# Altium schematic sheet AVR Board 4.0 Ports -Old.SchDoc
size A
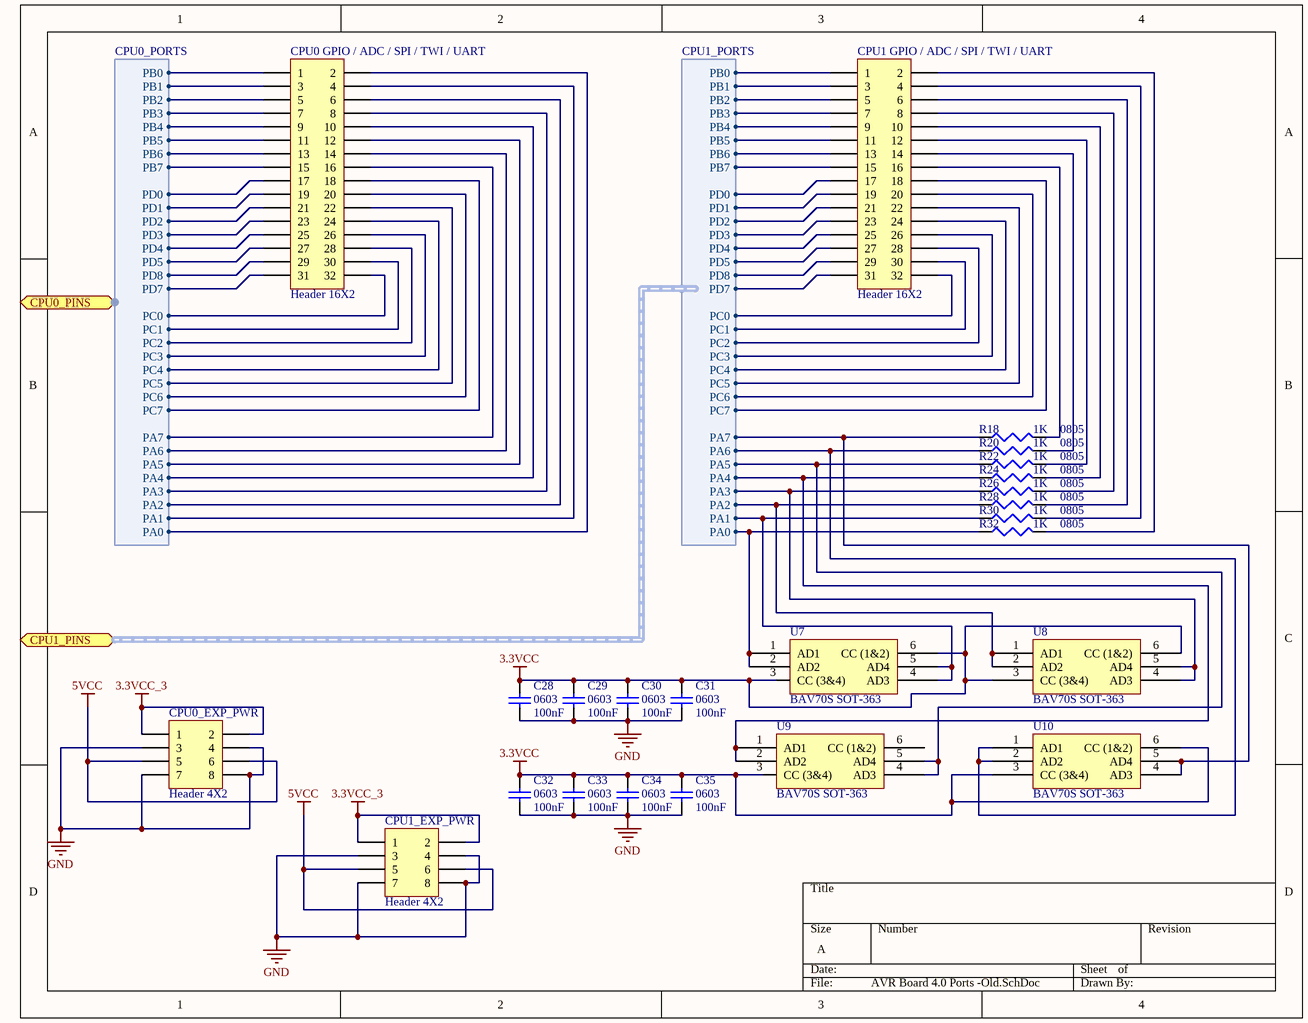
[diagram p0: AVR Board 4.0 Ports -Old.SchDoc]

## Parts
C28  0603  value 100nF  [C1206]
C29  0603  value 100nF  [C1206]
C30  0603  value 100nF  [C1206]
C31  0603  value 100nF  [C1206]
C32  0603  value 100nF  [C1206]
C33  0603  value 100nF  [C1206]
C34  0603  value 100nF  [C1206]
C35  0603  value 100nF  [C1206]
CPU0_EXP_PWR  Header 4X2  [HDR2X4]
CPU0_GPIO_/_ADC_/_SPI_/_TWI_/_UART  Header 16X2  [HDR2X16]
CPU1_EXP_PWR  Header 4X2  [HDR2X4]
CPU1_GPIO_/_ADC_/_SPI_/_TWI_/_UART  Header 16X2  [HDR2X16]
R18  0805  value 1K  [SM 0805 - gap trimmed]
R20  0805  value 1K  [SM 0805 - gap trimmed]
R22  0805  value 1K  [SM 0805 - gap trimmed]
R24  0805  value 1K  [SM 0805 - gap trimmed]
R26  0805  value 1K  [SM 0805 - gap trimmed]
R28  0805  value 1K  [SM 0805 - gap trimmed]
R30  0805  value 1K  [SM 0805 - gap trimmed]
R32  0805  value 1K  [SM 0805 - gap trimmed]
U7  BAV70S SOT-363  [BAV70S_SOT363]
U8  BAV70S SOT-363  [BAV70S_SOT363]
U9  BAV70S SOT-363  [BAV70S_SOT363]
U10  BAV70S SOT-363  [BAV70S_SOT363]

## Ports
CPU0_PINS (harness CPU0_PORTS), CPU1_PINS (harness CPU1_PORTS)

## Harnesses
CPU0_PORTS: PA0, PA1, PA2, PA3, PA4, PA5, PA6, PA7, PC0, PC1, PC2, PC3, PC4, PC5, PC6, PC7, PD7, PD8, PD5, PD4, PD3, PD2, PD1, PD0, PB7, PB6, PB5, PB4, PB3, PB2, PB1, PB0
CPU1_PORTS: PA0, PA1, PA2, PA3, PA4, PA5, PA6, PA7, PC0, PC1, PC2, PC3, PC4, PC5, PC6, PC7, PD7, PD8, PD5, PD4, PD3, PD2, PD1, PD0, PB7, PB6, PB5, PB4, PB3, PB2, PB1, PB0

## Nets
3.3VCC: C28.2 C29.2 C30.2 C31.2 C32.2 C33.2 C34.2 C35.2 U7.3(CC_(3&4)) U7.6(CC_(1&2)) U8.3(CC_(3&4)) U8.6(CC_(1&2)) U9.3(CC_(3&4)) U10.3(CC_(3&4)) U10.6(CC_(1&2))
3.3VCC_3: CPU0_EXP_PWR.1 CPU0_EXP_PWR.2 CPU1_EXP_PWR.1 CPU1_EXP_PWR.2
5VCC: CPU0_EXP_PWR.5 CPU0_EXP_PWR.6 CPU1_EXP_PWR.5 CPU1_EXP_PWR.6
GND: C28.1 C29.1 C30.1 C31.1 C32.1 C33.1 C34.1 C35.1 CPU0_EXP_PWR.3 CPU0_EXP_PWR.4 CPU0_EXP_PWR.7 CPU0_EXP_PWR.8 CPU1_EXP_PWR.3 CPU1_EXP_PWR.4 CPU1_EXP_PWR.7 CPU1_EXP_PWR.8
NetCPU0_GPIO_/_ADC_/_SPI_/_TWI_/_UART_1: CPU0_GPIO_/_ADC_/_SPI_/_TWI_/_UART.1 ; port CPU0_PINS.PB0
NetCPU0_GPIO_/_ADC_/_SPI_/_TWI_/_UART_2: CPU0_GPIO_/_ADC_/_SPI_/_TWI_/_UART.2 ; port CPU0_PINS.PA0
NetCPU0_GPIO_/_ADC_/_SPI_/_TWI_/_UART_3: CPU0_GPIO_/_ADC_/_SPI_/_TWI_/_UART.3 ; port CPU0_PINS.PB1
NetCPU0_GPIO_/_ADC_/_SPI_/_TWI_/_UART_4: CPU0_GPIO_/_ADC_/_SPI_/_TWI_/_UART.4 ; port CPU0_PINS.PA1
NetCPU0_GPIO_/_ADC_/_SPI_/_TWI_/_UART_5: CPU0_GPIO_/_ADC_/_SPI_/_TWI_/_UART.5 ; port CPU0_PINS.PB2
NetCPU0_GPIO_/_ADC_/_SPI_/_TWI_/_UART_6: CPU0_GPIO_/_ADC_/_SPI_/_TWI_/_UART.6 ; port CPU0_PINS.PA2
NetCPU0_GPIO_/_ADC_/_SPI_/_TWI_/_UART_7: CPU0_GPIO_/_ADC_/_SPI_/_TWI_/_UART.7 ; port CPU0_PINS.PB3
NetCPU0_GPIO_/_ADC_/_SPI_/_TWI_/_UART_8: CPU0_GPIO_/_ADC_/_SPI_/_TWI_/_UART.8 ; port CPU0_PINS.PA3
NetCPU0_GPIO_/_ADC_/_SPI_/_TWI_/_UART_9: CPU0_GPIO_/_ADC_/_SPI_/_TWI_/_UART.9 ; port CPU0_PINS.PB4
NetCPU0_GPIO_/_ADC_/_SPI_/_TWI_/_UART_10: CPU0_GPIO_/_ADC_/_SPI_/_TWI_/_UART.10 ; port CPU0_PINS.PA4
NetCPU0_GPIO_/_ADC_/_SPI_/_TWI_/_UART_11: CPU0_GPIO_/_ADC_/_SPI_/_TWI_/_UART.11 ; port CPU0_PINS.PB5
NetCPU0_GPIO_/_ADC_/_SPI_/_TWI_/_UART_12: CPU0_GPIO_/_ADC_/_SPI_/_TWI_/_UART.12 ; port CPU0_PINS.PA5
NetCPU0_GPIO_/_ADC_/_SPI_/_TWI_/_UART_13: CPU0_GPIO_/_ADC_/_SPI_/_TWI_/_UART.13 ; port CPU0_PINS.PB6
NetCPU0_GPIO_/_ADC_/_SPI_/_TWI_/_UART_14: CPU0_GPIO_/_ADC_/_SPI_/_TWI_/_UART.14 ; port CPU0_PINS.PA6
NetCPU0_GPIO_/_ADC_/_SPI_/_TWI_/_UART_15: CPU0_GPIO_/_ADC_/_SPI_/_TWI_/_UART.15 ; port CPU0_PINS.PB7
NetCPU0_GPIO_/_ADC_/_SPI_/_TWI_/_UART_16: CPU0_GPIO_/_ADC_/_SPI_/_TWI_/_UART.16 ; port CPU0_PINS.PA7
NetCPU0_GPIO_/_ADC_/_SPI_/_TWI_/_UART_17: CPU0_GPIO_/_ADC_/_SPI_/_TWI_/_UART.17 ; port CPU0_PINS.PD0
NetCPU0_GPIO_/_ADC_/_SPI_/_TWI_/_UART_18: CPU0_GPIO_/_ADC_/_SPI_/_TWI_/_UART.18 ; port CPU0_PINS.PC7
NetCPU0_GPIO_/_ADC_/_SPI_/_TWI_/_UART_19: CPU0_GPIO_/_ADC_/_SPI_/_TWI_/_UART.19 ; port CPU0_PINS.PD1
NetCPU0_GPIO_/_ADC_/_SPI_/_TWI_/_UART_20: CPU0_GPIO_/_ADC_/_SPI_/_TWI_/_UART.20 ; port CPU0_PINS.PC6
NetCPU0_GPIO_/_ADC_/_SPI_/_TWI_/_UART_21: CPU0_GPIO_/_ADC_/_SPI_/_TWI_/_UART.21 ; port CPU0_PINS.PD2
NetCPU0_GPIO_/_ADC_/_SPI_/_TWI_/_UART_22: CPU0_GPIO_/_ADC_/_SPI_/_TWI_/_UART.22 ; port CPU0_PINS.PC5
NetCPU0_GPIO_/_ADC_/_SPI_/_TWI_/_UART_23: CPU0_GPIO_/_ADC_/_SPI_/_TWI_/_UART.23 ; port CPU0_PINS.PD3
NetCPU0_GPIO_/_ADC_/_SPI_/_TWI_/_UART_24: CPU0_GPIO_/_ADC_/_SPI_/_TWI_/_UART.24 ; port CPU0_PINS.PC4
NetCPU0_GPIO_/_ADC_/_SPI_/_TWI_/_UART_25: CPU0_GPIO_/_ADC_/_SPI_/_TWI_/_UART.25 ; port CPU0_PINS.PD4
NetCPU0_GPIO_/_ADC_/_SPI_/_TWI_/_UART_26: CPU0_GPIO_/_ADC_/_SPI_/_TWI_/_UART.26 ; port CPU0_PINS.PC3
NetCPU0_GPIO_/_ADC_/_SPI_/_TWI_/_UART_27: CPU0_GPIO_/_ADC_/_SPI_/_TWI_/_UART.27 ; port CPU0_PINS.PD5
NetCPU0_GPIO_/_ADC_/_SPI_/_TWI_/_UART_28: CPU0_GPIO_/_ADC_/_SPI_/_TWI_/_UART.28 ; port CPU0_PINS.PC2
NetCPU0_GPIO_/_ADC_/_SPI_/_TWI_/_UART_29: CPU0_GPIO_/_ADC_/_SPI_/_TWI_/_UART.29 ; port CPU0_PINS.PD8
NetCPU0_GPIO_/_ADC_/_SPI_/_TWI_/_UART_30: CPU0_GPIO_/_ADC_/_SPI_/_TWI_/_UART.30 ; port CPU0_PINS.PC1
NetCPU0_GPIO_/_ADC_/_SPI_/_TWI_/_UART_31: CPU0_GPIO_/_ADC_/_SPI_/_TWI_/_UART.31 ; port CPU0_PINS.PD7
NetCPU0_GPIO_/_ADC_/_SPI_/_TWI_/_UART_32: CPU0_GPIO_/_ADC_/_SPI_/_TWI_/_UART.32 ; port CPU0_PINS.PC0
NetCPU1_GPIO_/_ADC_/_SPI_/_TWI_/_UART_1: CPU1_GPIO_/_ADC_/_SPI_/_TWI_/_UART.1 ; port CPU1_PINS.PB0
NetCPU1_GPIO_/_ADC_/_SPI_/_TWI_/_UART_2: CPU1_GPIO_/_ADC_/_SPI_/_TWI_/_UART.2 R32.2
NetCPU1_GPIO_/_ADC_/_SPI_/_TWI_/_UART_3: CPU1_GPIO_/_ADC_/_SPI_/_TWI_/_UART.3 ; port CPU1_PINS.PB1
NetCPU1_GPIO_/_ADC_/_SPI_/_TWI_/_UART_4: CPU1_GPIO_/_ADC_/_SPI_/_TWI_/_UART.4 R30.2
NetCPU1_GPIO_/_ADC_/_SPI_/_TWI_/_UART_5: CPU1_GPIO_/_ADC_/_SPI_/_TWI_/_UART.5 ; port CPU1_PINS.PB2
NetCPU1_GPIO_/_ADC_/_SPI_/_TWI_/_UART_6: CPU1_GPIO_/_ADC_/_SPI_/_TWI_/_UART.6 R28.2
NetCPU1_GPIO_/_ADC_/_SPI_/_TWI_/_UART_7: CPU1_GPIO_/_ADC_/_SPI_/_TWI_/_UART.7 ; port CPU1_PINS.PB3
NetCPU1_GPIO_/_ADC_/_SPI_/_TWI_/_UART_8: CPU1_GPIO_/_ADC_/_SPI_/_TWI_/_UART.8 R26.2
NetCPU1_GPIO_/_ADC_/_SPI_/_TWI_/_UART_9: CPU1_GPIO_/_ADC_/_SPI_/_TWI_/_UART.9 ; port CPU1_PINS.PB4
NetCPU1_GPIO_/_ADC_/_SPI_/_TWI_/_UART_10: CPU1_GPIO_/_ADC_/_SPI_/_TWI_/_UART.10 R24.2
NetCPU1_GPIO_/_ADC_/_SPI_/_TWI_/_UART_11: CPU1_GPIO_/_ADC_/_SPI_/_TWI_/_UART.11 ; port CPU1_PINS.PB5
NetCPU1_GPIO_/_ADC_/_SPI_/_TWI_/_UART_12: CPU1_GPIO_/_ADC_/_SPI_/_TWI_/_UART.12 R22.2
NetCPU1_GPIO_/_ADC_/_SPI_/_TWI_/_UART_13: CPU1_GPIO_/_ADC_/_SPI_/_TWI_/_UART.13 ; port CPU1_PINS.PB6
NetCPU1_GPIO_/_ADC_/_SPI_/_TWI_/_UART_14: CPU1_GPIO_/_ADC_/_SPI_/_TWI_/_UART.14 R20.2
NetCPU1_GPIO_/_ADC_/_SPI_/_TWI_/_UART_15: CPU1_GPIO_/_ADC_/_SPI_/_TWI_/_UART.15 ; port CPU1_PINS.PB7
NetCPU1_GPIO_/_ADC_/_SPI_/_TWI_/_UART_16: CPU1_GPIO_/_ADC_/_SPI_/_TWI_/_UART.16 R18.2
NetCPU1_GPIO_/_ADC_/_SPI_/_TWI_/_UART_17: CPU1_GPIO_/_ADC_/_SPI_/_TWI_/_UART.17 ; port CPU1_PINS.PD0
NetCPU1_GPIO_/_ADC_/_SPI_/_TWI_/_UART_18: CPU1_GPIO_/_ADC_/_SPI_/_TWI_/_UART.18 ; port CPU1_PINS.PC7
NetCPU1_GPIO_/_ADC_/_SPI_/_TWI_/_UART_19: CPU1_GPIO_/_ADC_/_SPI_/_TWI_/_UART.19 ; port CPU1_PINS.PD1
NetCPU1_GPIO_/_ADC_/_SPI_/_TWI_/_UART_20: CPU1_GPIO_/_ADC_/_SPI_/_TWI_/_UART.20 ; port CPU1_PINS.PC6
NetCPU1_GPIO_/_ADC_/_SPI_/_TWI_/_UART_21: CPU1_GPIO_/_ADC_/_SPI_/_TWI_/_UART.21 ; port CPU1_PINS.PD2
NetCPU1_GPIO_/_ADC_/_SPI_/_TWI_/_UART_22: CPU1_GPIO_/_ADC_/_SPI_/_TWI_/_UART.22 ; port CPU1_PINS.PC5
NetCPU1_GPIO_/_ADC_/_SPI_/_TWI_/_UART_23: CPU1_GPIO_/_ADC_/_SPI_/_TWI_/_UART.23 ; port CPU1_PINS.PD3
NetCPU1_GPIO_/_ADC_/_SPI_/_TWI_/_UART_24: CPU1_GPIO_/_ADC_/_SPI_/_TWI_/_UART.24 ; port CPU1_PINS.PC4
NetCPU1_GPIO_/_ADC_/_SPI_/_TWI_/_UART_25: CPU1_GPIO_/_ADC_/_SPI_/_TWI_/_UART.25 ; port CPU1_PINS.PD4
NetCPU1_GPIO_/_ADC_/_SPI_/_TWI_/_UART_26: CPU1_GPIO_/_ADC_/_SPI_/_TWI_/_UART.26 ; port CPU1_PINS.PC3
NetCPU1_GPIO_/_ADC_/_SPI_/_TWI_/_UART_27: CPU1_GPIO_/_ADC_/_SPI_/_TWI_/_UART.27 ; port CPU1_PINS.PD5
NetCPU1_GPIO_/_ADC_/_SPI_/_TWI_/_UART_28: CPU1_GPIO_/_ADC_/_SPI_/_TWI_/_UART.28 ; port CPU1_PINS.PC2
NetCPU1_GPIO_/_ADC_/_SPI_/_TWI_/_UART_29: CPU1_GPIO_/_ADC_/_SPI_/_TWI_/_UART.29 ; port CPU1_PINS.PD8
NetCPU1_GPIO_/_ADC_/_SPI_/_TWI_/_UART_30: CPU1_GPIO_/_ADC_/_SPI_/_TWI_/_UART.30 ; port CPU1_PINS.PC1
NetCPU1_GPIO_/_ADC_/_SPI_/_TWI_/_UART_31: CPU1_GPIO_/_ADC_/_SPI_/_TWI_/_UART.31 ; port CPU1_PINS.PD7
NetCPU1_GPIO_/_ADC_/_SPI_/_TWI_/_UART_32: CPU1_GPIO_/_ADC_/_SPI_/_TWI_/_UART.32 ; port CPU1_PINS.PC0
NetR18_1: R18.1 U10.4(AD3) U10.5(AD4) ; port CPU1_PINS.PA7
NetR20_1: R20.1 U10.1(AD1) U10.2(AD2) ; port CPU1_PINS.PA6
NetR22_1: R22.1 U9.4(AD3) U9.5(AD4) ; port CPU1_PINS.PA5
NetR24_1: R24.1 U9.1(AD1) U9.2(AD2) ; port CPU1_PINS.PA4
NetR26_1: R26.1 U8.4(AD3) U8.5(AD4) ; port CPU1_PINS.PA3
NetR28_1: R28.1 U8.1(AD1) U8.2(AD2) ; port CPU1_PINS.PA2
NetR30_1: R30.1 U7.4(AD3) U7.5(AD4) ; port CPU1_PINS.PA1
NetR32_1: R32.1 U7.1(AD1) U7.2(AD2) ; port CPU1_PINS.PA0

Not connected (* = marked no-connect by the designer): U9 6(CC_(1&2))

## Library data of the parts
C28-C35 = Cap Semi: Capacitor (Semiconductor SIM Model); Published: 8-Jun-2000; LatestRevisionDate: 29-May-2009; LatestRevisionNote: IPC-7351 Footprint Added.; PackageReference: C1206; Publisher: Altium Limited; PackageDescription: Chip Capacitor
CPU0_EXP_PWR CPU1_EXP_PWR = Header 4X2: Header, 4-Pin, Dual row; LatestRevisionDate: 17-Jul-2002; LatestRevisionNote: Re-released for DXP Platform.; Publisher: Altium Limited
CPU0_GPIO_/_ADC_/_SPI_/_TWI_/_UART CPU1_GPIO_/_ADC_/_SPI_/_TWI_/_UART = Header 16X2: Header, 16-Pin, Dual row; LatestRevisionDate: 17-Jul-2002; LatestRevisionNote: Re-released for DXP Platform.; Publisher: Altium Limited
R18 R20 R22 R24 R26 R28 R30 R32 = Res3: Resistor; Published: 8-Jun-2000; LatestRevisionDate: 29-May-2009; LatestRevisionNote: IPC-7351 Footprint Added.; PackageReference: J1-0603; Publisher: Altium Limited; PackageDescription: Chip Resistor